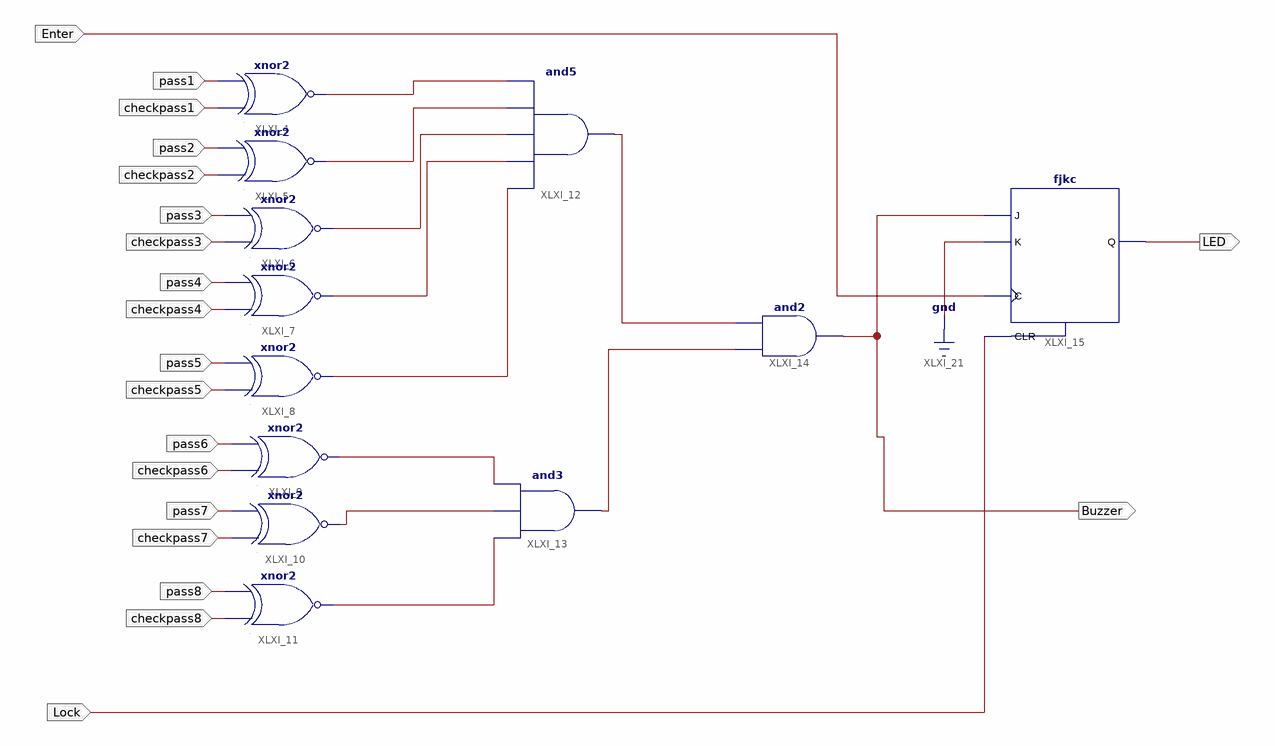
[diagram p0: schematic sheet 1]
// Xilinx ISE schematic checkpass.sch (spartan6) as structural Verilog: 12 symbols, 20 ports
module checkpass (
  input  Lock,
  input  pass1,
  input  checkpass1,
  input  pass2,
  input  checkpass2,
  input  pass3,
  input  checkpass3,
  input  pass4,
  input  checkpass4,
  input  pass5,
  input  checkpass5,
  input  pass6,
  input  checkpass6,
  input  pass7,
  input  checkpass7,
  input  pass8,
  input  checkpass8,
  input  Enter,
  output LED,
  output Buzzer
);

  wire XLXN_7, XLXN_8, XLXN_9, XLXN_10, XLXN_11, XLXN_12, XLXN_14, XLXN_15, XLXN_16, XLXN_17;

  xnor XLXI_4 (XLXN_7, checkpass1, pass1);
  xnor XLXI_5 (XLXN_8, checkpass2, pass2);
  xnor XLXI_6 (XLXN_9, checkpass3, pass3);
  xnor XLXI_7 (XLXN_10, checkpass4, pass4);
  xnor XLXI_8 (XLXN_11, checkpass5, pass5);
  xnor XLXI_9 (XLXN_12, checkpass6, pass6);
  xnor XLXI_10 (XLXN_14, checkpass7, pass7);
  xnor XLXI_11 (XLXN_15, checkpass8, pass8);
  and XLXI_12 (XLXN_16, XLXN_11, XLXN_10, XLXN_9, XLXN_8, XLXN_7);
  and XLXI_13 (XLXN_17, XLXN_15, XLXN_14, XLXN_12);
  and XLXI_14 (Buzzer, XLXN_17, XLXN_16);
  fjkc XLXI_15 (.C(Enter), .CLR(Lock), .J(Buzzer), .K(1'b0), .Q(LED));
endmodule
